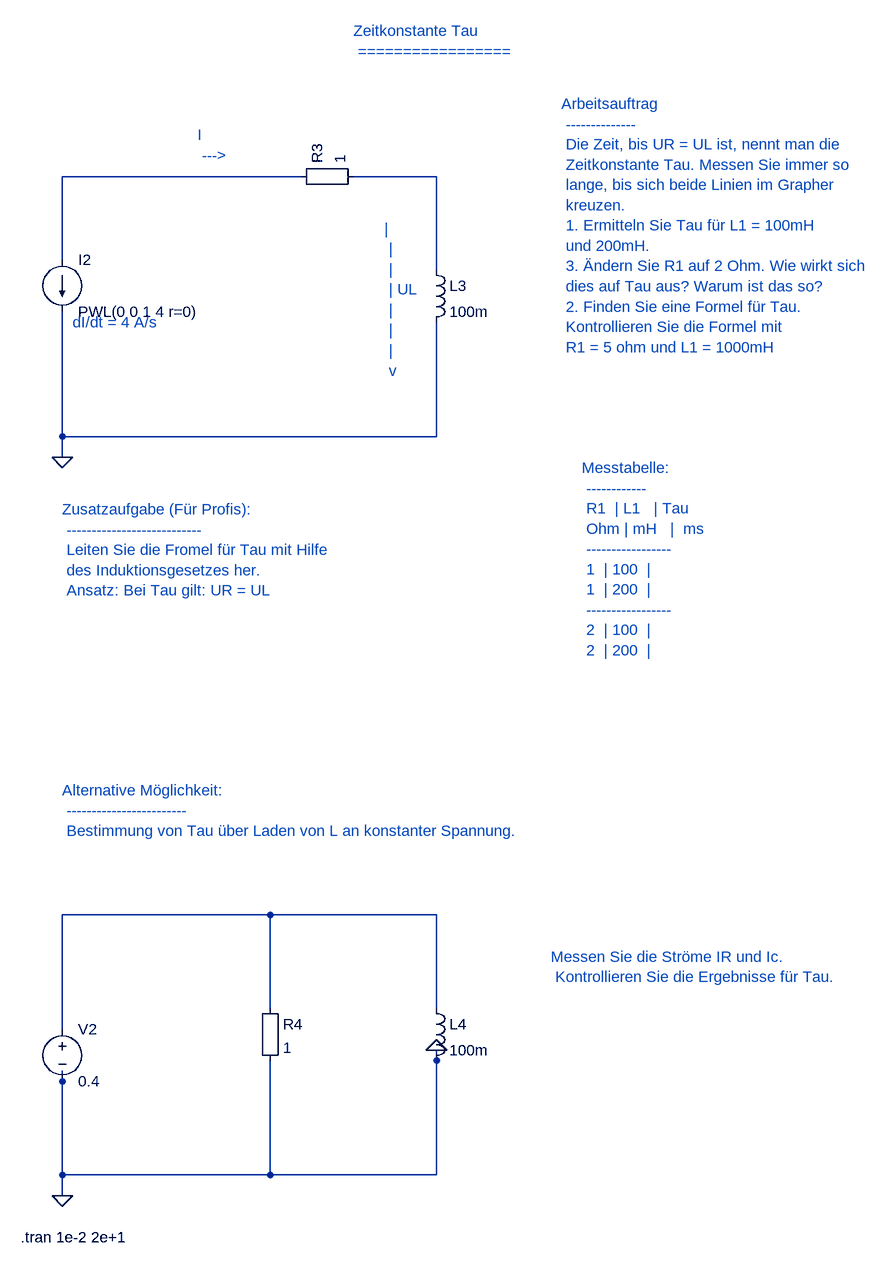
[diagram p0: schematic 1_2_2_L_Zeitkonstante_mit_U.asc]
1_2_2_L_Zeitkonstante_mit_U.asc, the LTspice schematic file:
Version 4
SHEET 1 880 680
WIRE 128 496 128 512
WIRE 128 1680 128 1664
WIRE 704 512 704 688
WIRE 704 688 128 688
WIRE 128 416 128 288
WIRE 128 288 496 288
WIRE 128 688 128 720
WIRE 128 512 128 688
WIRE 576 288 704 288
WIRE 704 288 704 432
WIRE 128 1600 128 1424
WIRE 128 1424 448 1424
WIRE 128 1824 128 1856
WIRE 128 1664 128 1824
WIRE 704 1648 704 1824
WIRE 704 1824 448 1824
WIRE 448 1424 704 1424
WIRE 704 1424 704 1568
WIRE 448 1568 448 1424
WIRE 448 1824 128 1824
WIRE 448 1648 448 1824
WIRE 704 1648 704 1632
FLAG 128 720 0
FLAG 128 1856 0
FLAG 704 1632 0
FLAG 128 720 0
SYMBOL Misc\EuropeanResistor 480 304 R270
SYMATTR InstName R3
SYMATTR Value 1
SYMBOL ind 688 416 R0
SYMATTR InstName L3
SYMATTR Value 100m
SYMBOL current 128 416 R0
SYMATTR InstName I2
SYMATTR Value PWL(0 0 1 4 r=0)
SYMBOL Misc\EuropeanResistor 432 1552 R0
SYMATTR InstName R4
SYMATTR Value 1
SYMBOL ind 688 1552 R0
SYMATTR InstName L4
SYMATTR Value 100m
SYMBOL voltage 128 1584 R0
SYMATTR InstName V2
SYMATTR Value 0.4
TEXT 64 1920 Left 2 !.tran 1e-2 2e+1
TEXT 576 64 Left 2 ;Zeitkonstante Tau \n =================
TEXT 896 176 Left 2 ;Arbeitsauftrag \n -------------- \n Die Zeit, bis UR = UL ist, nennt man die \n Zeitkonstante Tau. Messen Sie immer so \n lange, bis sich beide Linien im Grapher \n kreuzen. \n 1. Ermitteln Sie Tau für L1 = 100mH \n und 200mH. \n 3. Ändern Sie R1 auf 2 Ohm. Wie wirkt sich \n dies auf Tau aus? Warum ist das so? \n 2. Finden Sie eine Formel für Tau. \n Kontrollieren Sie die Formel mit \n R1 = 5 ohm und L1 = 1000mH
TEXT 336 224 Left 2 ;I \n --->
TEXT 624 368 Left 2 ;| \n | \n | \n | UL \n | \n | \n | \n v
TEXT 928 736 Left 2 ;Messtabelle: \n ------------ \n R1  | L1   | Tau \n Ohm | mH   |  ms \n ----------------- \n 1  | 100  | \n 1  | 200  | \n ----------------- \n 2  | 100  | \n 2  | 200  |
TEXT 128 800 Left 2 ;Zusatzaufgabe (Für Profis): \n --------------------------- \n Leiten Sie die Fromel für Tau mit Hilfe \n des Induktionsgesetzes her. \n Ansatz: Bei Tau gilt: UR = UL
TEXT 144 512 Left 2 ;dI/dt = 4 A/s
TEXT 128 1232 Left 2 ;Alternative Möglichkeit: \n ------------------------ \n Bestimmung von Tau über Laden von L an konstanter Spannung.
TEXT 880 1488 Left 2 ;Messen Sie die Ströme IR und Ic. \n Kontrollieren Sie die Ergebnisse für Tau.

The netlist it stands for:
* 1_2_2_L_Zeitkonstante_mit_U.asc
R3 N001 N002 1
L3 N002 0 100m
I2 N001 0 PWL(0 0 1 4 r=0)
R4 N003 0 1
L4 N003 0 100m
V2 N003 0 0.4
.tran 1e-2 2e+1
* Zeitkonstante Tau
*  =================
* Arbeitsauftrag
*  --------------
*  Die Zeit, bis UR = UL ist, nennt man die
*  Zeitkonstante Tau. Messen Sie immer so
*  lange, bis sich beide Linien im Grapher
*  kreuzen.
*  1. Ermitteln Sie Tau für L1 = 100mH
*  und 200mH.
*  3. Ändern Sie R1 auf 2 Ohm. Wie wirkt sich
*  dies auf Tau aus? Warum ist das so?
*  2. Finden Sie eine Formel für Tau.
*  Kontrollieren Sie die Formel mit
*  R1 = 5 ohm und L1 = 1000mH
* I
*  --->
* |
*  |
*  |
*  | UL
*  |
*  |
*  |
*  v
* Messtabelle:
*  ------------
*  R1  | L1   | Tau
*  Ohm | mH   |  ms
*  -----------------
*  1  | 100  |
*  1  | 200  |
*  -----------------
*  2  | 100  |
*  2  | 200  |
* Zusatzaufgabe (Für Profis):
*  ---------------------------
*  Leiten Sie die Fromel für Tau mit Hilfe
*  des Induktionsgesetzes her.
*  Ansatz: Bei Tau gilt: UR = UL
* dI/dt = 4 A/s
* Alternative Möglichkeit:
*  ------------------------
*  Bestimmung von Tau über Laden von L an konstanter Spannung.
* Messen Sie die Ströme IR und Ic.
*  Kontrollieren Sie die Ergebnisse für Tau.
.backanno
.end